# Altium schematic sheet main.SchDoc
size 840 x 594 mm; CheckedBy: Шемаров; Author: Миронь; DrawnBy: Миронь; Organization: БГУИР, 750701; DocumentNumber: ГУИР.203719.001 Э3; SheetNumber: 1; SheetTotal: 1; Title1str: Система обеспечения; Title2str: безопасности котельной
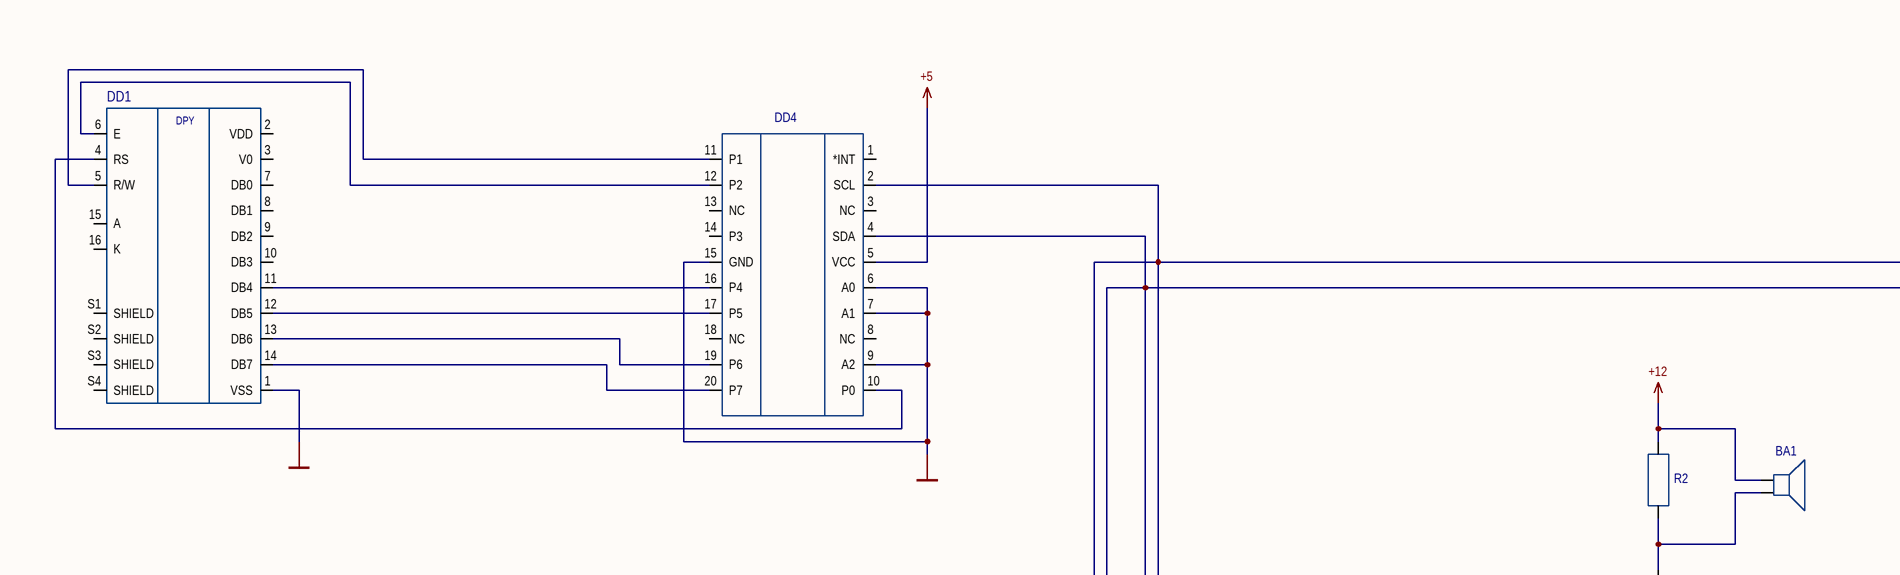
[diagram p0: main.SchDoc, top left]
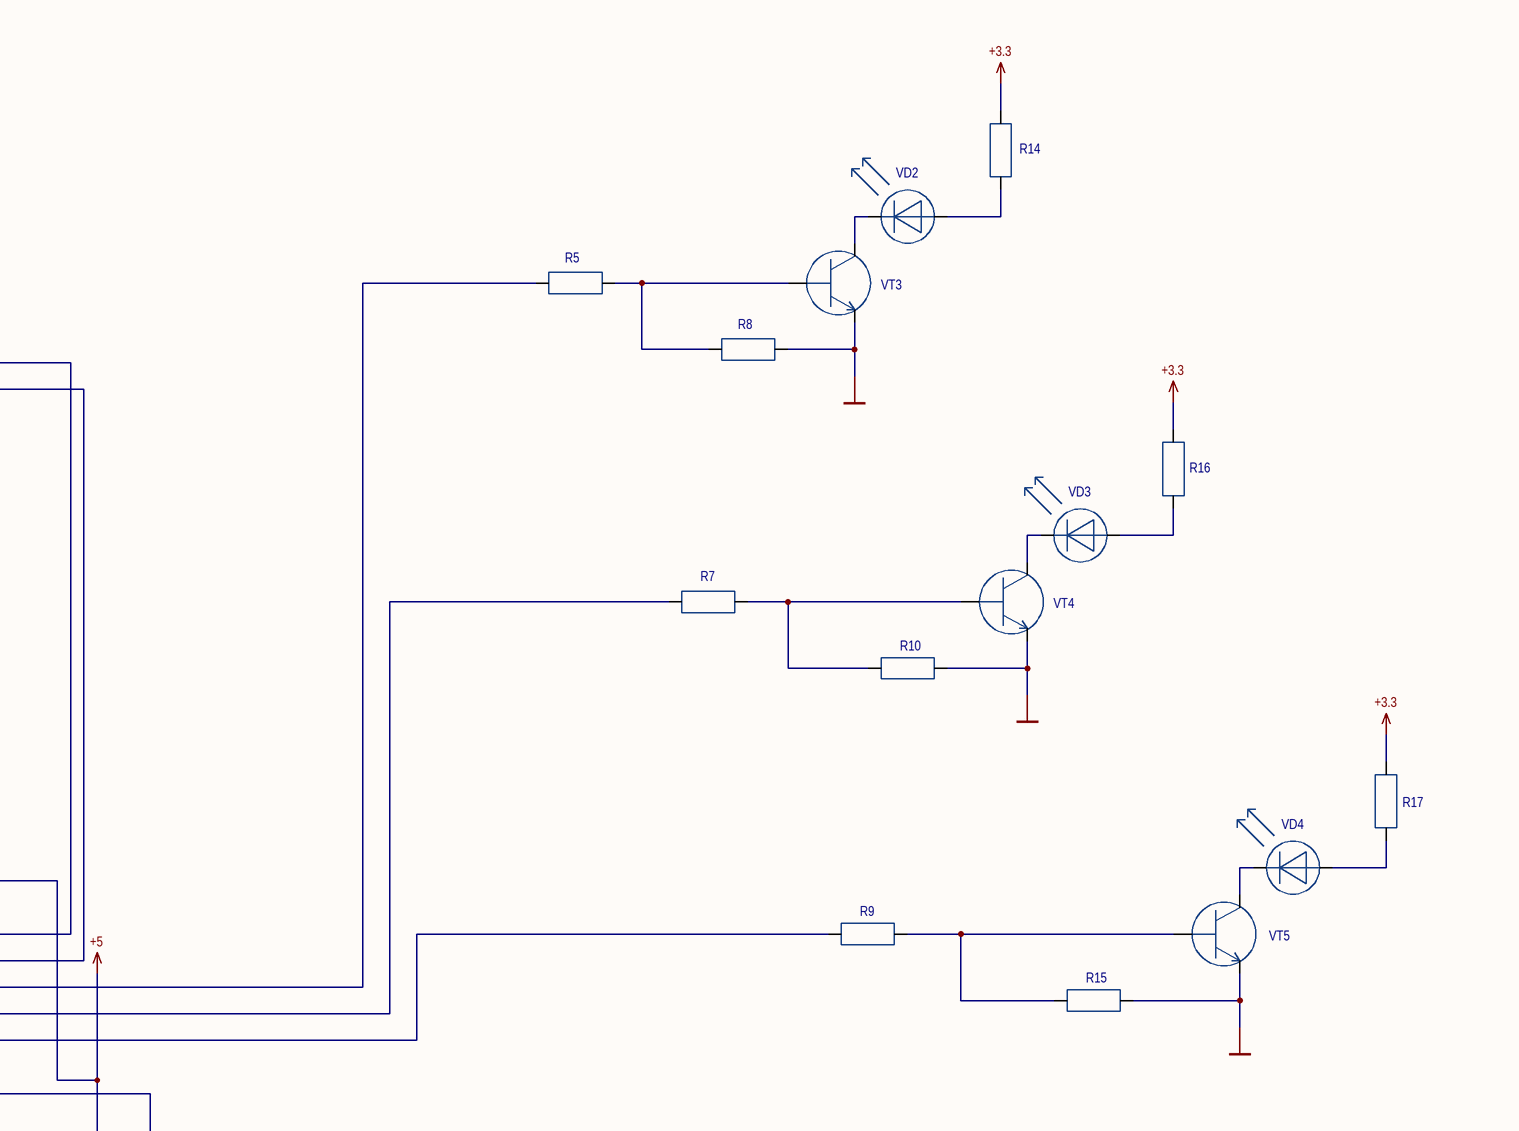
[diagram p1: main.SchDoc, top right]
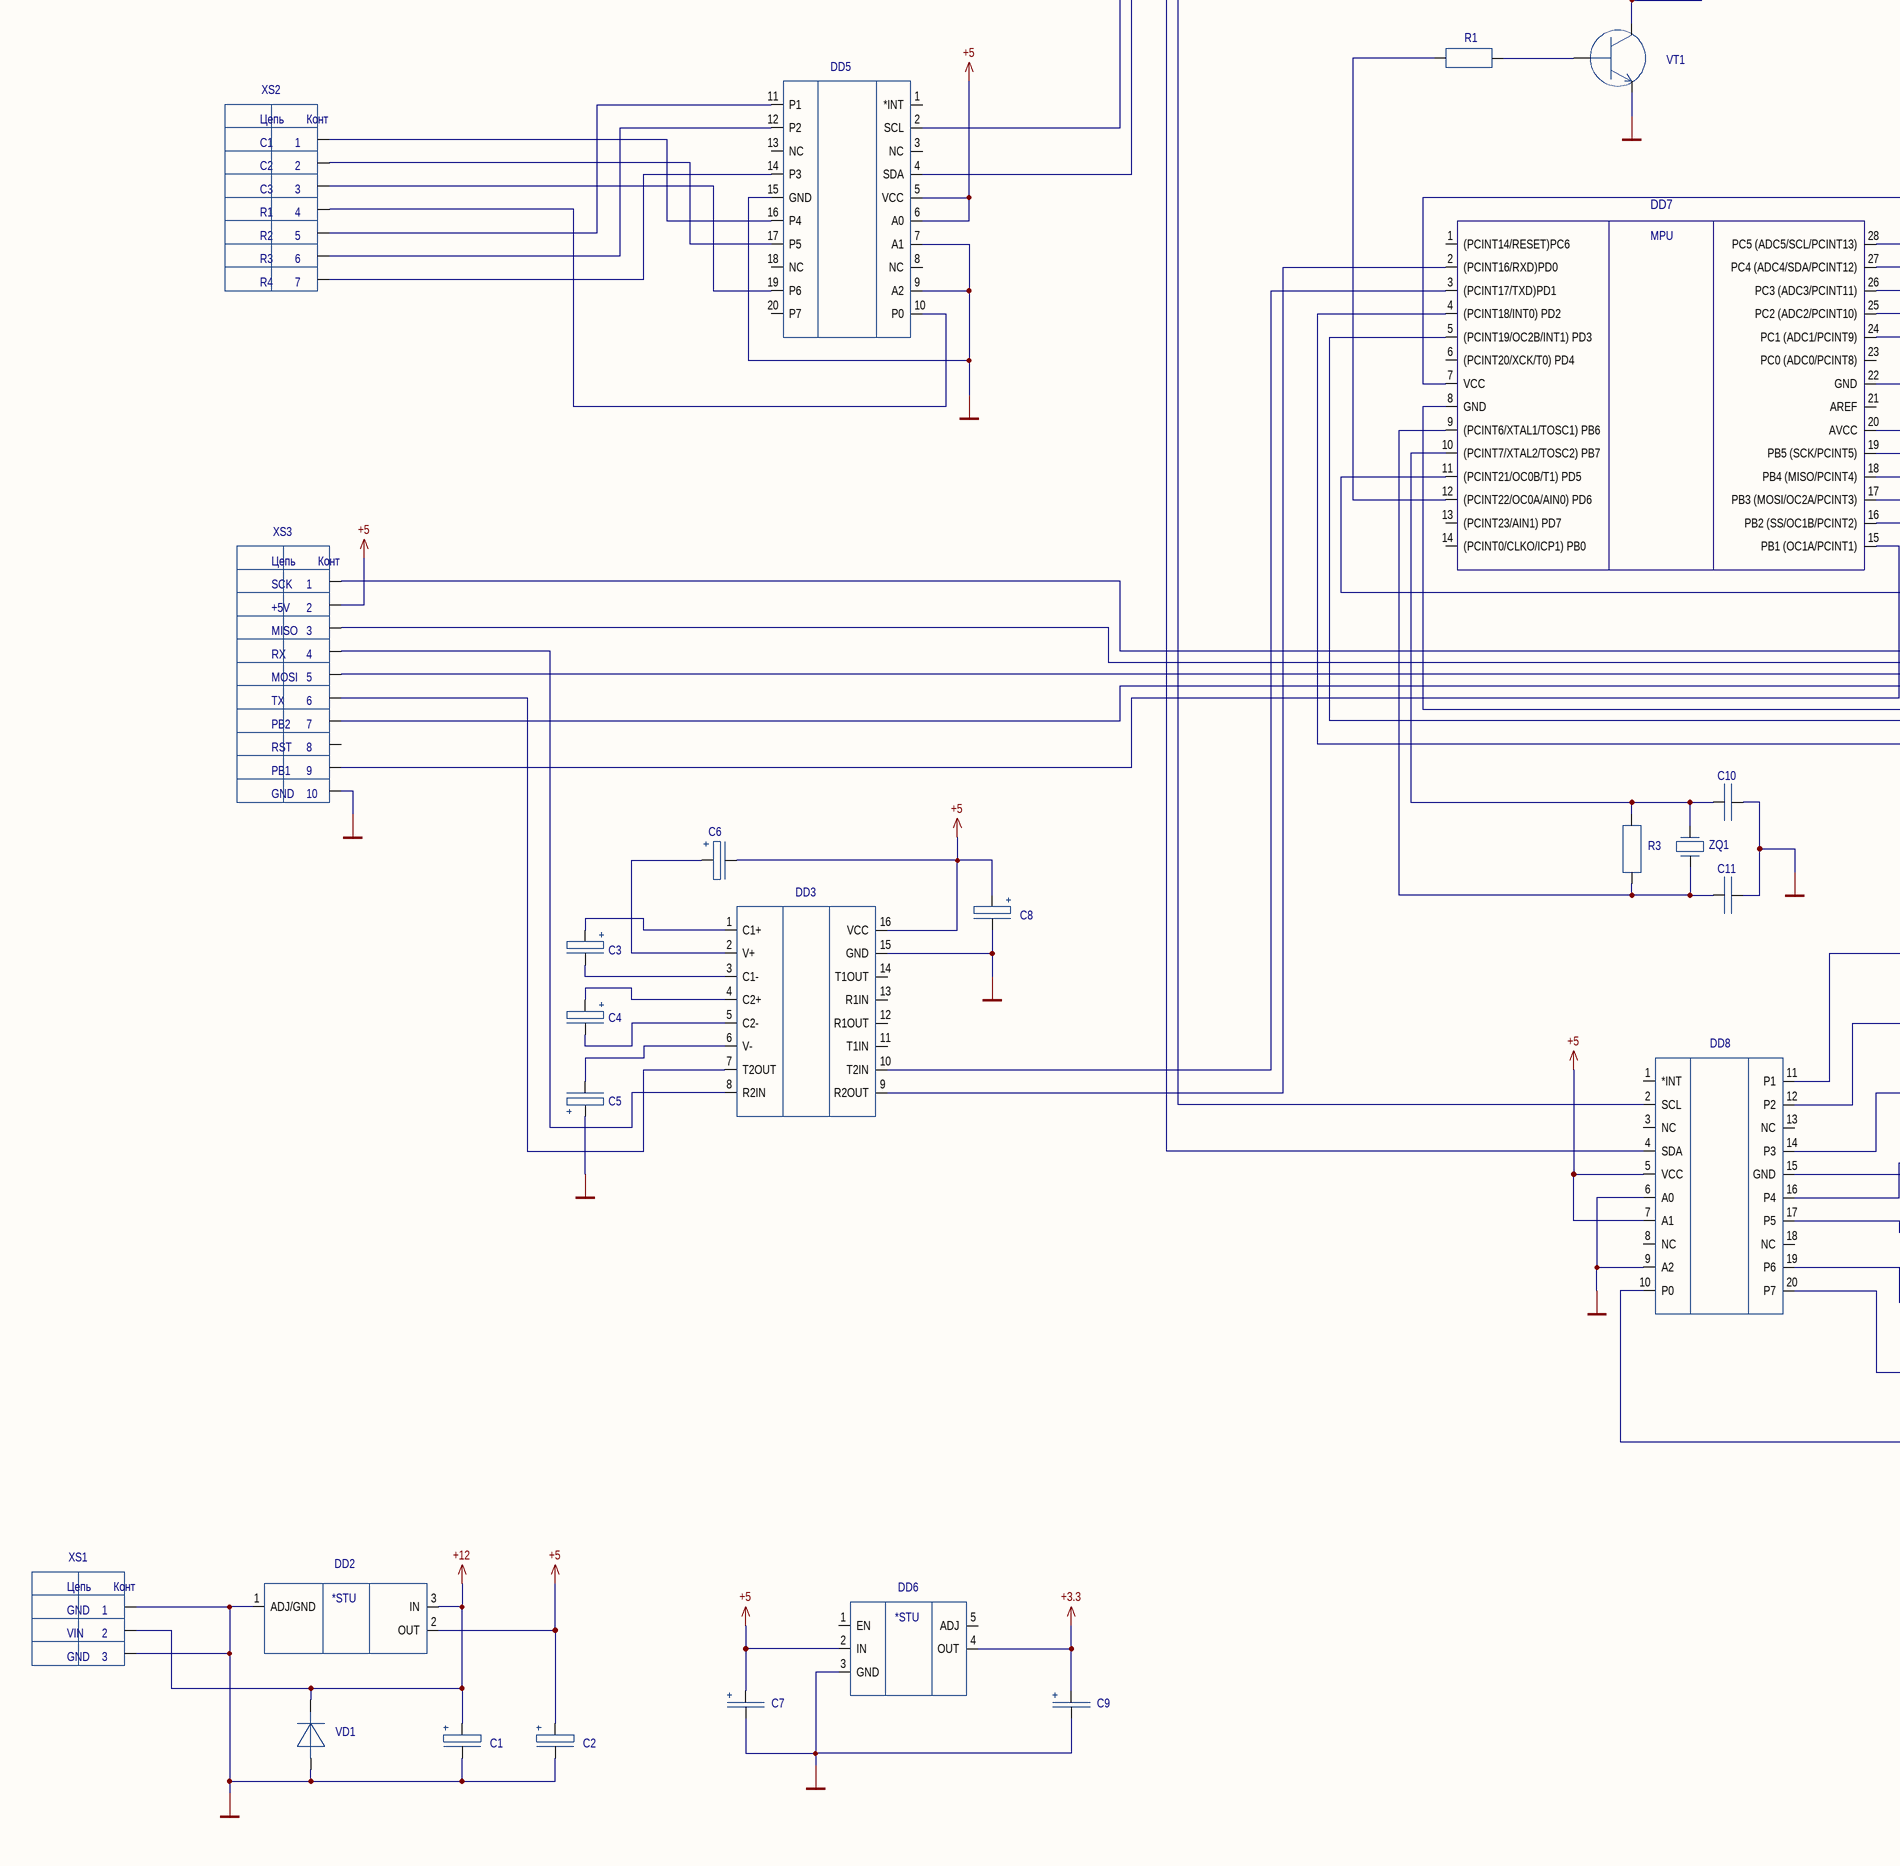
[diagram p2: main.SchDoc, bottom left]
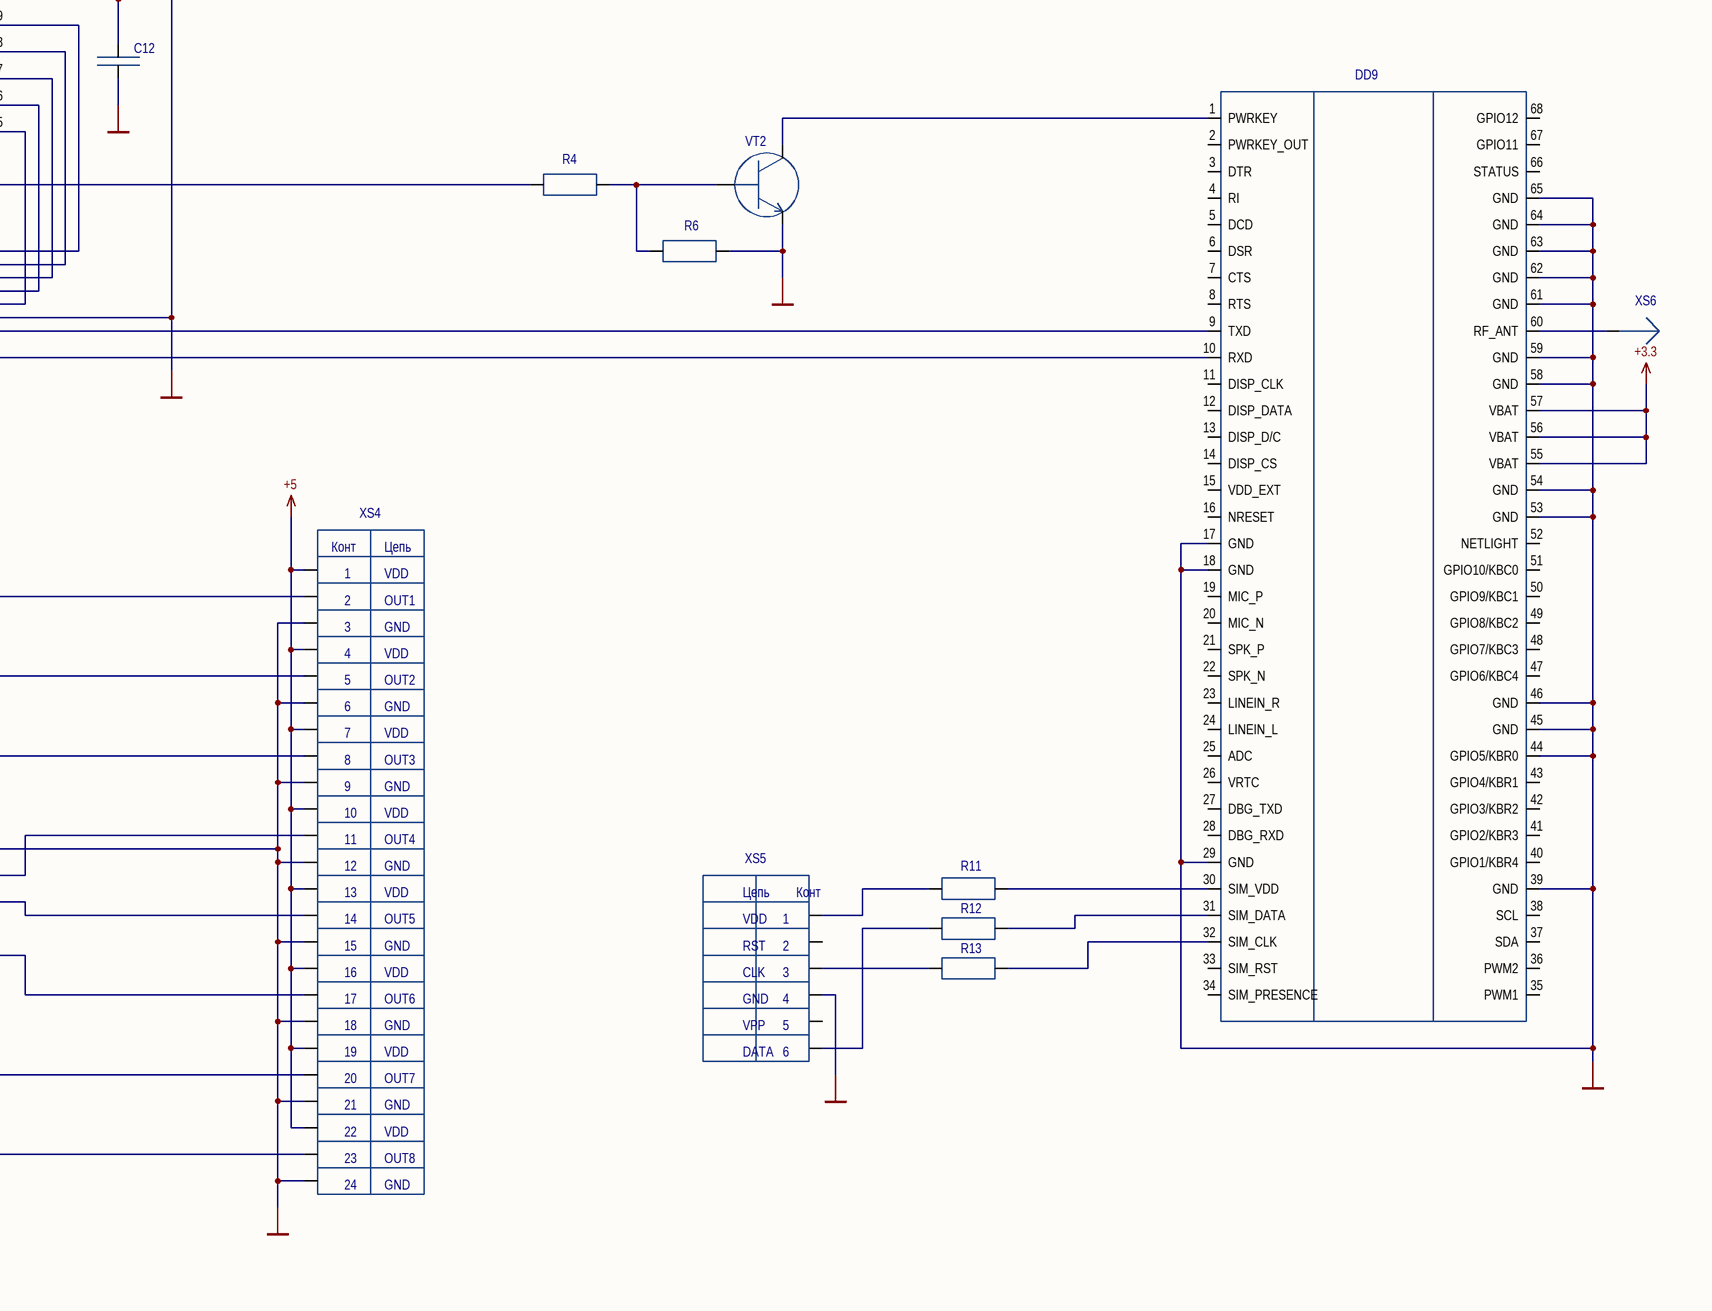
[diagram p3: main.SchDoc, bottom right]

## Parts
BA1  speaker_CVS-1508  [SPeaKeR_CVS-1508]  (value not drawn)
C1  pol_10mkF  [PCAP_6_3x11THRU-ELECT_NCA]  (value not drawn)
C2  pol_10mkF  [PCAP_6_3x11THRU-ELECT_NCA]  (value not drawn)
C3  pol_1mkF  [PCAP_5x11-THRU-ELECT_NCA]  (value not drawn)
C4  pol_1mkF  [PCAP_5x11-THRU-ELECT_NCA]  (value not drawn)
C5  pol_1mkF  [PCAP_5x11-THRU-ELECT_NCA]  (value not drawn)
C6  pol_1mkF  [PCAP_5x11-THRU-ELECT_NCA]  (value not drawn)
C7  pol_100mkF  [CAP_0805_GRM]  (value not drawn)
C8  pol_1mkF  [PCAP_5x11-THRU-ELECT_NCA]  (value not drawn)
C9  pol_100mkF  [CAP_0805_GRM]  (value not drawn)
C10  33pF  [CAP_0805_GRM]  (value not drawn)
C11  33pF  [CAP_0805_GRM]  (value not drawn)
C12  33pF  [CAP_0805_GRM]  (value not drawn)
DD1  LCD-20X4B  [LCD_LCD-20X4B]  (value not drawn)
DD2  NCP1117ST50T3G  [SOT223-3_ONS]  (value not drawn)
DD3  MAX232CSE+  [max232_dip16]  (value not drawn)
DD4  PCF8574DGVR  [SOT38-4_NXP]  (value not drawn)
DD5  PCF8574DGVR  [SOT38-4_NXP]  (value not drawn)
DD6  stu_MIC29302WT  [TO-263-5_MCH]  (value not drawn)
DD7  ATMEGA328P-PU  [28P3_ATM]  (value not drawn)
DD8  PCF8574DGVR  [SOT38-4_NXP]  (value not drawn)
DD9  SIM900A  [SIM800A_SMM]  (value not drawn)
R1  res_4.7k  [RC0805N_YAG]  (value not drawn)
R2  res_4.7k  [RC0805N_YAG]  (value not drawn)
R3  res_1M  [RC0805N_YAG]  (value not drawn)
R4  res_4.7k  [RC0805N_YAG]  (value not drawn)
R5  res_4.7k  [RC0805N_YAG]  (value not drawn)
R6  res_4.7k  [RC0805N_YAG]  (value not drawn)
R7  res_4.7k  [RC0805N_YAG]  (value not drawn)
R8  res_4.7k  [RC0805N_YAG]  (value not drawn)
R9  res_4.7k  [RC0805N_YAG]  (value not drawn)
R10  res_4.7k  [RC0805N_YAG]  (value not drawn)
R11  res_4.7k  [RC0805N_YAG]  (value not drawn)
R12  res_4.7k  [RC0805N_YAG]  (value not drawn)
R13  res_4.7k  [RC0805N_YAG]  (value not drawn)
R14  res_510  [RC0805N_YAG]  (value not drawn)
R15  res_4.7k  [RC0805N_YAG]  (value not drawn)
R16  res_510  [RC0805N_YAG]  (value not drawn)
R17  res_510  [RC0805N_YAG]  (value not drawn)
VD1  diode_M7  [M7_DO-214AC_DTC]  (value not drawn)
VD2  diode_red  [LED_151054RS03000]  (value not drawn)
VD3  diode_yellow  [LED_151054RS03000]  (value not drawn)
VD4  diode_green  [LED_151054RS03000]  (value not drawn)
VT1  BC547A  [TO-92-3_ONS]  (value not drawn)
VT2  BC547A  [TO-92-3_ONS]  (value not drawn)
VT3  BC547A  [TO-92-3_ONS]  (value not drawn)
VT4  BC547A  [TO-92-3_ONS]  (value not drawn)
VT5  BC547A  [TO-92-3_ONS]  (value not drawn)
XS1  DCJ200-10  [conn_DCJ200-10]  (value not drawn)
XS2  conn_Keypad  [conn_7pin_TSW-107-05-G-D]  (value not drawn)
XS3  BH-10  [conn_10pin_TE_5-102570-3]  (value not drawn)
XS4  ds1013  [conn_24pin_TSW-108-08-T-T]  (value not drawn)
XS5  SIM7200-6-0-18-00-X_REVA  [CONN_SIM7200-6-0-18-00-X_REVA]  (value not drawn)
XS6  antenn_RECE.20279.001E.01  [conn_antenn_901-9894-RFX]  (value not drawn)
ZQ1  HC-49S  [CRYSTAL_HC49S_MTC]  (value not drawn)

## Nets
+3.3: C9.2 DD6.4(OUT) DD9.55(VBAT) DD9.56(VBAT) DD9.57(VBAT) R14.2 R16.2 R17.2
+5: C2.2 C6.1 C7.2 C8.2 C12.2 DD2.2(OUT) DD3.16(VCC) DD4.5(VCC) DD5.5(VCC) DD5.6(A0) DD6.2(IN) DD7.7(VCC) DD7.20(AVCC) DD8.5(VCC) DD8.7(A1) XS3.2(VDD) XS4.1(VSS) XS4.4(C/D) XS4.7(D0) XS4.10(D3) XS4.13(D6) XS4.16 XS4.19 XS4.22
+12: BA1.1 C1.2 DD2.3(IN) R2.2 VD1.2 XS1.2(GND)
GND: C1.1 C2.1 C5.2 C7.1 C8.1 C9.1 C10.2 C11.2 C12.1 DD1.1(VSS) DD2.1(ADJ/GND) DD3.15(GND) DD4.6(A0) DD4.7(A1) DD4.9(A2) DD4.15(GND) DD5.7(A1) DD5.9(A2) DD5.15(GND) DD6.3(GND) DD7.8(GND) DD7.22(GND) DD8.6(A0) DD8.9(A2) DD8.15(GND) DD9.17(GND) DD9.18(GND) DD9.29(GND) DD9.39(GND) DD9.44(GPIO5/KBR0) DD9.45(GND) DD9.46(GND) DD9.53(GND) DD9.54(GND) DD9.58(GND) DD9.59(GND) DD9.61(GND) DD9.62(GND) DD9.63(GND) DD9.64(GND) DD9.65(GND) R6.2 R8.2 R10.2 R15.2 VD1.1 VT1.1(E) VT2.1(E) VT3.1(E) VT4.1(E) VT5.1(E) XS1.1(+5V) XS1.3(SCL) XS3.10(D3) XS4.3(VO) XS4.6(*WR) XS4.9(D2) XS4.12(D5) XS4.15 XS4.18 XS4.21 XS4.24 XS5.4(GND)
NetBA1_2: BA1.2 R2.1 VT1.3(C)
NetC3_1: C3.1 DD3.3(C1-)
NetC3_2: C3.2 DD3.1(C1+)
NetC4_1: C4.1 DD3.5(C2-)
NetC4_2: C4.2 DD3.4(C2+)
NetC5_1: C5.1 DD3.6(V-)
NetC6_2: C6.2 DD3.2(V+)
NetC10_1: C10.1 DD7.10((PCINT7/XTAL2/TOSC2)_PB7) R3.2 ZQ1.2
NetC11_1: C11.1 DD7.9((PCINT6/XTAL1/TOSC1)_PB6) R3.1 ZQ1.1
NetDD1_4: DD1.4(RS) DD4.10(P0)
NetDD1_5: DD1.5(R/W) DD4.11(P1)
NetDD1_6: DD1.6(E) DD4.12(P2)
NetDD1_11: DD1.11(DB4) DD4.16(P4)
NetDD1_12: DD1.12(DB5) DD4.17(P5)
NetDD1_13: DD1.13(DB6) DD4.19(P6)
NetDD1_14: DD1.14(DB7) DD4.20(P7)
NetDD3_7: DD3.7(T2OUT) XS3.6(*WR)
NetDD3_8: DD3.8(R2IN) XS3.4(C/D)
NetDD3_9: DD3.9(R2OUT) DD7.2((PCINT16/RXD)PD0)
NetDD3_10: DD3.10(T2IN) DD7.3((PCINT17/TXD)PD1)
NetDD4_2: DD4.2(SCL) DD5.2(SCL) DD7.28(PC5_(ADC5/SCL/PCINT13)) DD8.2(SCL)
NetDD4_4: DD4.4(SDA) DD5.4(SDA) DD7.27(PC4_(ADC4/SDA/PCINT12)) DD8.4(SDA)
NetDD5_10: DD5.10(P0) XS2.4(C/D)
NetDD5_11: DD5.11(P1) XS2.5(*RD)
NetDD5_12: DD5.12(P2) XS2.6(*WR)
NetDD5_14: DD5.14(P3) XS2.7(D0)
NetDD5_16: DD5.16(P4) XS2.1(VSS)
NetDD5_17: DD5.17(P5) XS2.2(VDD)
NetDD5_19: DD5.19(P6) XS2.3(VO)
NetDD7_4: DD7.4((PCINT18/INT0)_PD2) DD9.10(RXD)
NetDD7_5: DD7.5((PCINT19/OC2B/INT1)_PD3) DD9.9(TXD)
NetDD7_11: DD7.11((PCINT21/OC0B/T1)_PD5) R4.1
NetDD7_12: DD7.12((PCINT22/OC0A/AIN0)_PD6) R1.2
NetDD7_15: DD7.15(PB1_(OC1A/PCINT1)) XS3.9(D2)
NetDD7_16: DD7.16(PB2_(SS/OC1B/PCINT2)) XS3.7(D0)
NetDD7_17: DD7.17(PB3_(MOSI/OC2A/PCINT3)) XS3.5(*RD)
NetDD7_18: DD7.18(PB4_(MISO/PCINT4)) XS3.3(VO)
NetDD7_19: DD7.19(PB5_(SCK/PCINT5)) XS3.1(VSS)
NetDD7_24: DD7.24(PC1_(ADC1/PCINT9)) R9.1
NetDD7_25: DD7.25(PC2_(ADC2/PCINT10)) R7.1
NetDD7_26: DD7.26(PC3_(ADC3/PCINT11)) R5.1
NetDD8_10: DD8.10(P0) XS4.23
NetDD8_11: DD8.11(P1) XS4.2(VDD)
NetDD8_12: DD8.12(P2) XS4.5(*RD)
NetDD8_14: DD8.14(P3) XS4.8(D1)
NetDD8_16: DD8.16(P4) XS4.11(D4)
NetDD8_17: DD8.17(P5) XS4.14(D7)
NetDD8_19: DD8.19(P6) XS4.17
NetDD8_20: DD8.20(P7) XS4.20
NetDD9_1: DD9.1(PWRKEY) VT2.3(C)
NetDD9_30: DD9.30(SIM_VDD) R11.2
NetDD9_31: DD9.31(SIM_DATA) R12.2
NetDD9_32: DD9.32(SIM_CLK) R13.2
NetDD9_60: DD9.60(RF_ANT) XS6.1
NetR1_1: R1.1 VT1.2(B)
NetR4_2: R4.2 R6.1 VT2.2(B)
NetR5_2: R5.2 R8.1 VT3.2(B)
NetR7_2: R7.2 R10.1 VT4.2(B)
NetR9_2: R9.2 R15.1 VT5.2(B)
NetR11_1: R11.1 XS5.1(VCC)
NetR12_1: R12.1 XS5.6(I/O)
NetR13_1: R13.1 XS5.3(CLK)
NetR14_1: R14.1 VD2.1
NetR16_1: R16.1 VD3.1
NetR17_1: R17.1 VD4.1
NetVD2_2: VD2.2 VT3.3(C)
NetVD3_2: VD3.2 VT4.3(C)
NetVD4_2: VD4.2 VT5.3(C)

Not connected (* = marked no-connect by the designer): DD1 2(VDD) 3(V0) 7(DB0) 8(DB1) 9(DB2) 10(DB3) 15(A) 16(K) S1(SHIELD) S2(SHIELD) S3(SHIELD) S4(SHIELD); DD3 11(T1IN) 12(R1OUT) 13(R1IN) 14(T1OUT); DD4 1(*INT) 3(NC) 8(NC) 13(NC) 14(P3) 18(NC); DD5 1(*INT) 3(NC) 8(NC) 13(NC) 18(NC) 20(P7); DD6 1(EN) 5(ADJ); DD7 1((PCINT14/RESET)PC6) 6((PCINT20/XCK/T0)_PD4) 13((PCINT23/AIN1)_PD7) 14((PCINT0/CLKO/ICP1)_PB0) 21(AREF) 23(PC0_(ADC0/PCINT8)); DD8 1(*INT) 3(NC) 8(NC) 13(NC) 18(NC); DD9 2(PWRKEY_OUT) 3(DTR) 4(RI) 5(DCD) 6(DSR) 7(CTS) 8(RTS) 11(DISP_CLK) 12(DISP_DATA) 13(DISP_D/C) 14(DISP_CS) 15(VDD_EXT) 16(NRESET) 19(MIC_P) 20(MIC_N) 21(SPK_P) 22(SPK_N) 23(LINEIN_R) 24(LINEIN_L) 25(ADC) 26(VRTC) 27(DBG_TXD) 28(DBG_RXD) 33(SIM_RST) 34(SIM_PRESENCE) 35(PWM1) 36(PWM2) 37(SDA) 38(SCL) 40(GPIO1/KBR4) 41(GPIO2/KBR3) 42(GPIO3/KBR2) 43(GPIO4/KBR1) 47(GPIO6/KBC4) 48(GPIO7/KBC3) 49(GPIO8/KBC2) 50(GPIO9/KBC1) 51(GPIO10/KBC0) 52(NETLIGHT) 66(STATUS) 67(GPIO11) 68(GPIO12); XS3 8(D1); XS5 2(RST) 5(VPP)

## Notes on the sheet
- Перв. примен.
- Справ. №
- Н.контр.
- Подп. и дата
- Инв. № дубл.
- Разраб.
- Взам. инв. №
- Изм.
- Лист
- № докум.
- Подп.
- Дата
- Лит.
- Масса
- Масштаб
- Пров.
- Т.контр.
- Листов
- Инв. № подл.
- Утв.
- Согласов.
- Копировал
- Формат  A1М
- (in symbol ATMEGA328P-PU) MPU
- (in symbol conn_DCJ200-10_powerIn) Цепь; Конт; VIN
- (in symbol conn_Keypad) Цепь; Конт; C1; C2; C3; R1; R2; R3; R4
- (in symbol conn_SIM7200) Цепь; Конт; VDD; DATA
- (in symbol LCD-20X4B) DPY
- (in symbol RS-232) Цепь; Конт; SCK; +5V; MISO; RX; MOSI; TX; PB2; RST; PB1; GND
- (in symbol stu_MIC29302WT) *STU
- (in symbol stu_NCP1117ST50T3G) *STU
- (in symbol temperature_sensors_connector) Конт; Цепь; OUT1; GND; OUT2; OUT3; OUT4; OUT5; OUT6; OUT7; OUT8

## Library data of the parts
C1 C2 = cap_pol_10mkF
C3-C6 C8 = cap_pol_1mkF
C7 C9 = cap_pol_100mkF
C10-C12 = cap_33pF
DD1 = LCD-20X4B: Display Development Tools 20X4 CHARACTER BLUE LCD W/BACKLIGHT; MF: Gravitech; Price: None; Value: *; Availability: Unavailable; Mouser-Purchase-URL: https://snapeda.com/shop?store=Mouser&id=833821; SnapEDA_Link: https://www.snapeda.com/parts/LCD-20X4B/Gravitech/view-part/833821/?ref=snap; MP: LCD-20X4B; Package: None
DD2 = stu_NCP1117ST50T3G: No Description Available; Vendor: ON Semiconductor; SourceLibrary: ONSemi_2017-12-12_4; Manufacturer_Part_Number: NCP1117ST50T3G; Copyright: Copyright (C) 2016 Accelerated Designs. All rights reserved; RefDes: RefDes; Type: DEV
DD3 = micro_MAX232: No Description Available; SourceLibrary: Update_to_database_2021-01-29; Built_By: EMA_UL_Team; Vendor: Maxim Integrated Products; Revision: 4; Manufacturer_Part_Number: MAX232CSE+; Copyright: Copyright (C) 2018 Accelerated Designs. All rights reserved; RefDes: RefDes; Type: DEV
DD4 DD5 DD8 = PCF8574DGVR: Remote 8-Bit I/O Expander for I2C-Bus; Manufacturer: Texas Instruments; INDUSTRY_STD_PKG_TYPE: TVSOP; FAMILY_NAME: I2C IO EXPANDER; PIN_COUNT: 20; PACKAGE_DESIGNATOR: DGV; Datasheet_URL: http://www.ti.com/lit/gpn/PCF8574; GENERIC_PART_NUMBER: PCF8574; Vendor: Texas Instruments; Manufacturer_Part_Number: PCF8574DGVR; Copyright: Copyright (C) 2018 Accelerated Designs. All rights reserved; RefDes: RefDes; Type: DEV
DD7 = ATMEGA328P-PU: No Description Available; Built_By: EMA_UL_Team; Vendor: Atmel; SourceLibrary: Atmel_2011-04-02; Manufacturer_Part_Number: ATMEGA328P-PU; Copyright: Copyright (C) 2018 Accelerated Designs. All rights reserved; RefDes: RefDes; Type: DEV
VD3 VD4 = diode_red
VT1-VT5 = trans_BC547A
XS1 = conn_DCJ200-10_powerIn
XS3 = RS-232
XS4 = temperature_sensors_connector
XS5 = conn_SIM7200: No Description Available; Manufacturer_Part_Number: SIM5051-6-0-18-00-A; Vendor: Global Connector Technology; Built_By: EMA_Cory; SourceLibrary: GCT_2020-07-23; Datasheet: https://gct.co/files/drawings/sim5051.pdf; Copyright: Copyright (C) 2018 Accelerated Designs. All rights reserved; RefDes: RefDes; Type: DEV
XS6 = conn_antenn
ZQ1 = crystal_8mhz